# EAGLE design ECS_device (EAGLE 5.11)
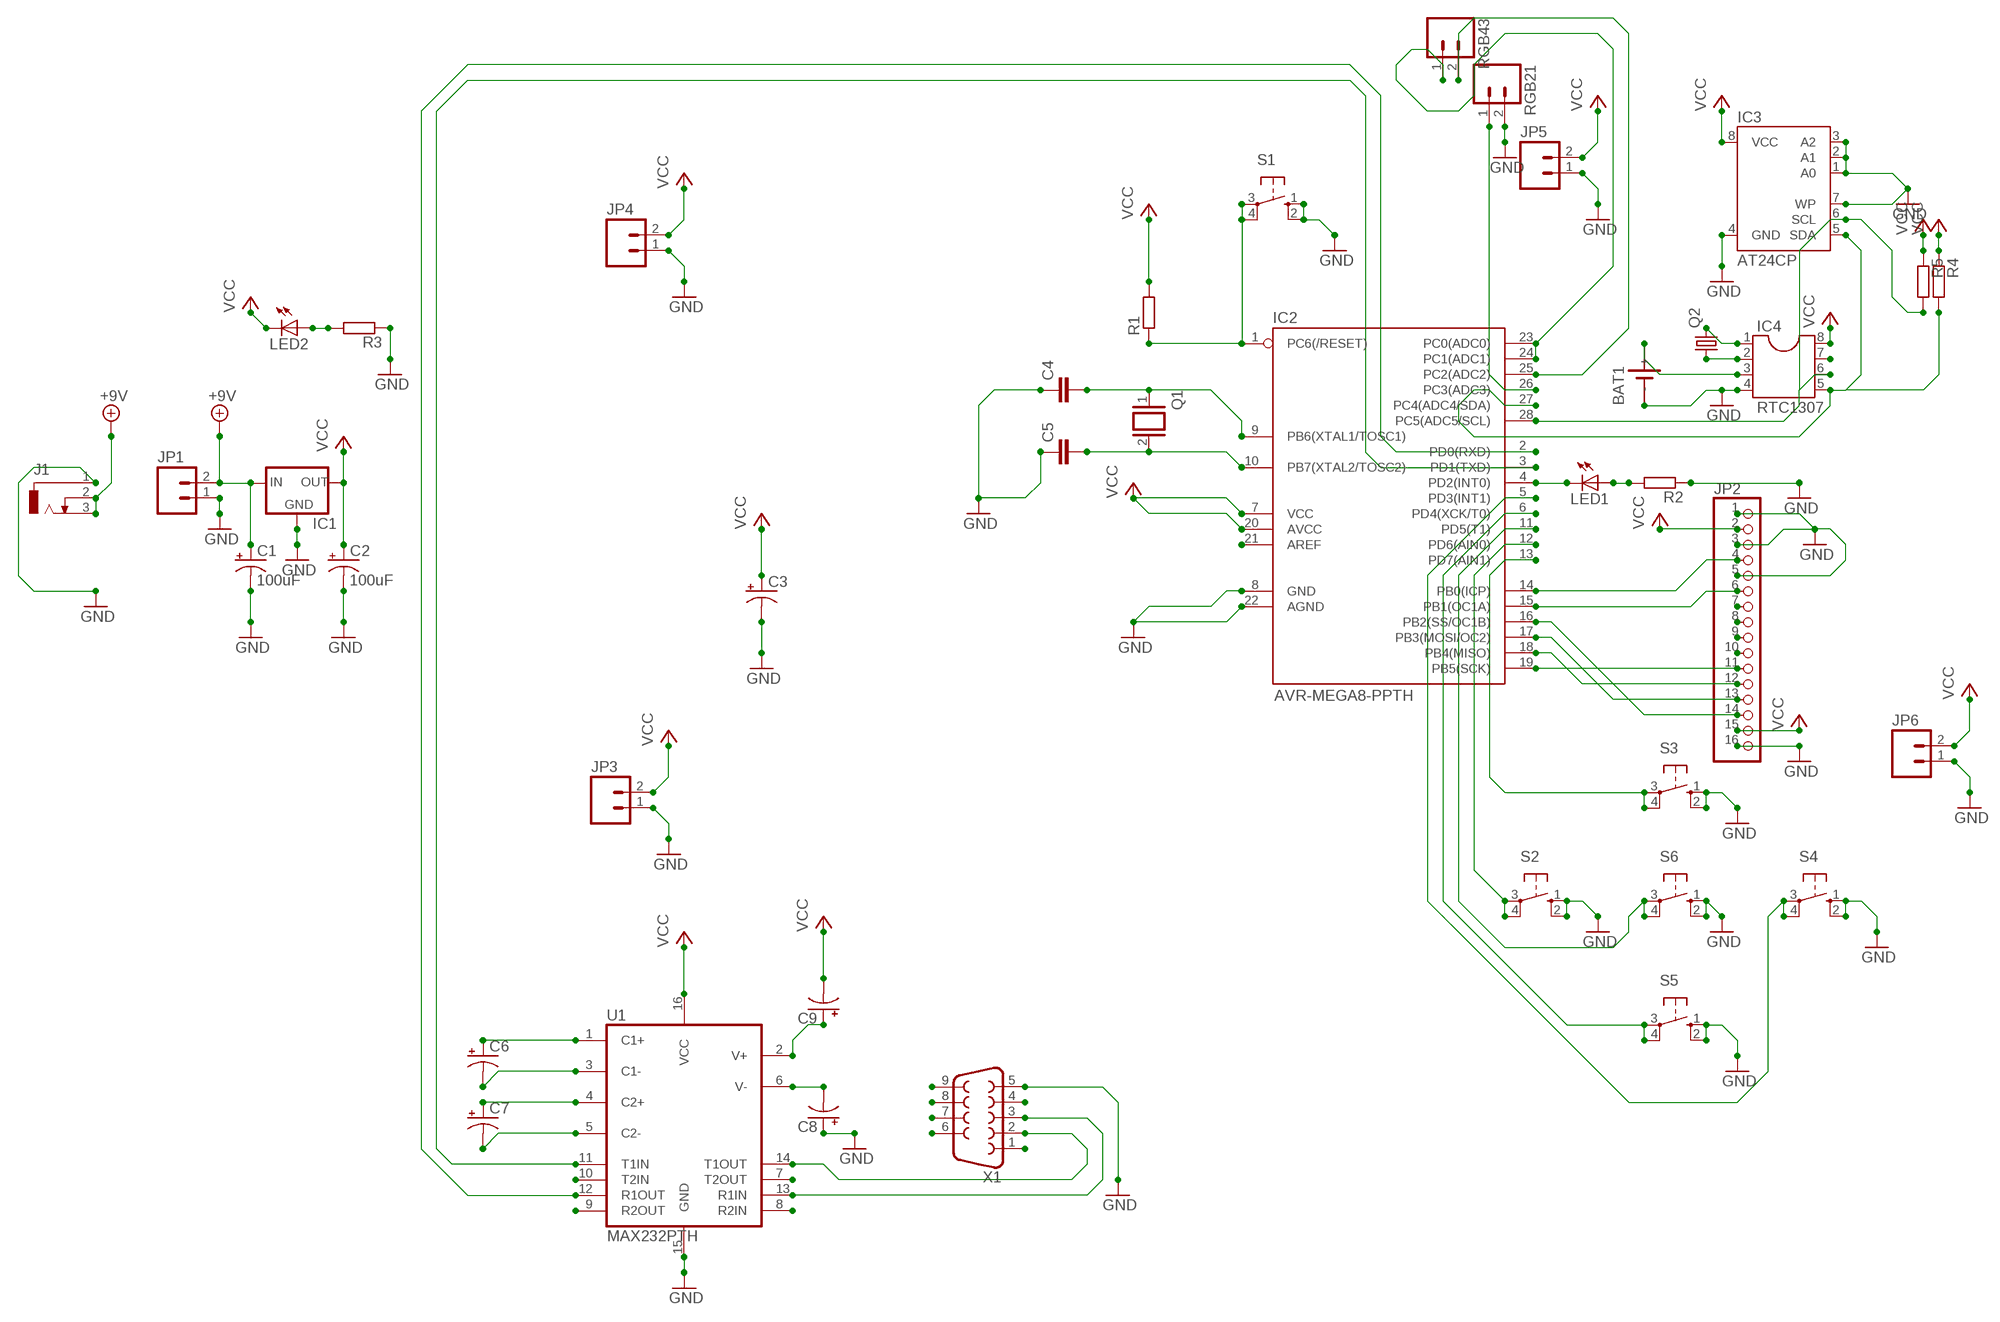
[diagram p0: schematic, sheet 1]

## Parts
BAT1  SN2032  [SN2032]
C1  100uF  CAP_POLPTH1  [CPOL-RADIAL-100UF-25V]
C2  100uF  CAP_POLPTH1  [CPOL-RADIAL-100UF-25V]
C3  CAP_POLPTH2  [CPOL-RADIAL-10UF-25V]
C4  CAPPTH1  [CAP-PTH-5MM]
C5  CAPPTH1  [CAP-PTH-5MM]
C6  CAP_POLPTH2  [CPOL-RADIAL-10UF-25V]
C7  CAP_POLPTH2  [CPOL-RADIAL-10UF-25V]
C8  CAP_POLPTH2  [CPOL-RADIAL-10UF-25V]
C9  CAP_POLPTH2  [CPOL-RADIAL-10UF-25V]
IC1  V_REG_78XX-TO-220  [TO-220-ALT]
IC2  AVR-MEGA8-PPTH  [DIL28-3]
IC3  AT24CP  [DIL08]
IC4  RTC1307  DIL8  [DIL08]
J1  DCJ0303  [DCJ0303]
JP1  M02PTH3  [1X02_LONGPADS]
JP2  PINHD-1X16/90  [1X16/90]
JP3  M02PTH3  [1X02_LONGPADS]
JP4  M02PTH3  [1X02_LONGPADS]
JP5  M02PTH3  [1X02_LONGPADS]
JP6  M02PTH3  [1X02_LONGPADS]
LED1  LEDSFH482  [SFH482]
LED2  LEDSFH482  [SFH482]
Q1  XTAL  [Q]
Q2  CRYSTALTC38H  [TC38H]
R1  R-EU_0309/12  [0309/12]
R2  R-EU_0309/12  [0309/12]
R3  R-EU_0309/12  [0309/12]
R4  R-EU_0309/12  [0309/12]
R5  R-EU_0309/12  [0309/12]
RGB21  M02PTH3  [1X02_LONGPADS]
RGB43  M02PTH3  [1X02_LONGPADS]
S1  10-XX  [B3F-10XX]
S2  10-XX  [B3F-10XX]
S3  10-XX  [B3F-10XX]
S4  10-XX  [B3F-10XX]
S5  10-XX  [B3F-10XX]
S6  10-XX  [B3F-10XX]
U1  MAX232PTH  [DIL16]
X1  DB9FEMALE  [DB9]

## Nets
+9V: C1.1(+) IC1.IN J1.2 J1.3 JP1.2
GND: BAT1.- C1.2(-) C2.2(-) C3.2(-) C4.1 C5.1 C8.1(+) IC1.GND IC2.8(GND) IC2.22(AGND) IC3.1(A0) IC3.2(A1) IC3.3(A2) IC3.4(GND) IC3.7(WP) IC4.4 J1.1 JP1.1 JP2.1 JP2.3 JP2.5 JP2.16 JP3.1 JP4.1 JP5.1 JP6.1 R2.1 R3.1 RGB21.2 S1.1(S) S1.2(S1) S2.1(S) S2.2(S1) S3.1(S) S3.2(S1) S4.1(S) S4.2(S1) S5.1(S) S5.2(S1) S6.1(S) S6.2(S1) U1.15(GND) X1.5
N$1: IC2.2(PD0(RXD)) U1.12(R1OUT)
N$3: IC2.21(AREF)
N$5: IC2.14(PB0(ICP)) JP2.4
N$6: IC2.28(PC5(ADC5/SCL)) IC3.6(SCL) IC4.6 R5.2
N$7: IC2.27(PC4(ADC4/SDA)) IC3.5(SDA) IC4.5 R4.2
N$8: C5.2 IC2.10(PB7(XTAL2/TOSC2)) Q1.2
N$9: C4.2 IC2.9(PB6(XTAL1/TOSC1)) Q1.1
N$19: IC2.1(PC6(/RESET)) R1.1 S1.3(P) S1.4(P1)
N$30: IC2.16(PB2(SS/OC1B)) JP2.14
N$31: IC2.17(PB3(MOSI/OC2)) JP2.13
N$32: IC2.18(PB4(MISO)) JP2.12
N$34: IC2.19(PB5(SCK)) JP2.11
N$35: JP2.10
N$36: JP2.9
N$37: JP2.8
N$38: JP2.7
N$39: C6.1(+) U1.1(C1+)
N$40: C6.2(-) U1.3(C1-)
N$41: C7.1(+) U1.4(C2+)
N$42: C7.2(-) U1.5(C2-)
N$43: IC2.3(PD1(TXD)) U1.11(T1IN)
N$44: U1.10(T2IN)
N$46: U1.9(R2OUT)
N$47: IC4.7
N$50: C8.2(-) U1.6(V-)
N$51: BAT1.+ IC4.3
N$52: U1.7(T2OUT)
N$53: IC4.2 Q2.1
N$54: U1.8(R2IN)
N$55: IC4.1 Q2.2
N$58: C9.1(+) U1.2(V+)
N$59: IC2.26(PC3(ADC3)) RGB21.1
N$60: X1.4
N$61: U1.13(R1IN) X1.3
N$62: U1.14(T1OUT) X1.2
N$63: X1.1
N$64: X1.6
N$65: X1.7
N$66: X1.8
N$67: X1.9
N$68: IC2.25(PC2(ADC2)) RGB43.2
N$69: IC2.24(PC1(ADC1)) RGB43.1
N$70: IC2.23(PC0(ADC0))
N$73: IC2.4(PD2(INT0)) LED1.K(C)
N$74: IC2.5(PD3(INT1)) S4.3(P) S4.4(P1)
N$75: IC2.6(PD4(XCK/T0)) S5.3(P) S5.4(P1)
N$76: IC2.11(PD5(T1)) S6.3(P) S6.4(P1)
N$77: IC2.12(PD6(AIN0)) S2.3(P) S2.4(P1)
N$78: IC2.13(PD7(AIN1)) S3.3(P) S3.4(P1)
N$80: IC2.15(PB1(OC1A)) JP2.6
N$86: LED1.A R2.2
N$90: LED2.A R3.2
VCC: C2.1(+) C3.1(+) C9.2(-) IC1.OUT IC2.7(VCC) IC2.20(AVCC) IC3.8(VCC) IC4.8 JP2.2 JP2.15 JP3.2 JP4.2 JP5.2 JP6.2 LED2.K(C) R1.2 R4.1 R5.1 U1.16(VCC)

## Library data of the parts
BAT1 = sn2032:SN2032: LI BATTERY
C1-C3 C6-C9 = SparkFun:CAP_POL: Capacitor Polarized These are standard SMD and PTH capacitors. Normally 10uF, 47uF, and 100uF in electrolytic and tantalum varieties. Always verify the external diameter of the through hole cap, it varies with capacity, voltage, and manufacturer. The EIA devices should be standard.
C4 C5 = SparkFun:CAP: Capacitor Standard 0603 ceramic capacitor, and 0.1" leaded capacitor.
IC1 = SparkFun:V_REG_78XX: Voltage Regulator Standard 7805 5V regulator. IGO (Input Ground Output). Spark Fun Electronics SKU : COM-00107
IC2 = SparkFun:AVR-MEGA8-P: MICROCONTROLLER 8 Kbytes FLASH 1 kbytes SRAM 512 bytes EEPROM USART 4-channel 10 bit ADC 2-channel 8 bit ADC
IC3 = atmel:AT24C*: 2-wire serial EEPROM; MPN: AT24C1024BW-SH-B; OC_FARNELL: 1362646; OC_NEWARK: 03P2044
IC4 = ic-package:DIL8: Dual In Line / Socket
J1 = con-jack:DCJ0303: DC POWER JACK Source: DCJ0303.pdf; OC_FARNELL: unknown; OC_NEWARK: unknown
JP1 JP3-JP6 RGB21 RGB43 = SparkFun:M02: Header 2 Standard 2-pin 0.1" header. Use with straight break away headers (SKU : PRT-00116), right angle break away headers (PRT-00553), swiss pins (PRT-00743), machine pins (PRT-00117), and female headers (PRT-00115). Molex polarized connector foot print use with SKU : PRT-08233 with associated crimp pins and housings.
JP2 = pinhead:PINHD-1X16: PIN HEADER
LED1 LED2 = led:LED: LED OSRAM: - CHIPLED LG R971, LG N971, LY N971, LG Q971, LY Q971, LO R971, LY R971 LH N974, LH R974 LS Q976, LO Q976, LY Q976 LO Q996 - Hyper CHIPLED LW Q18S LB Q993, LB Q99A, LB R99A - SideLED LS A670, LO A670, LY A670, LG A670, LP A670 LB A673, LV A673, LT A673, LW A673 LH A674 LY A675 LS A676, LA A676, LO A676, LY A676, LW A676 LS A679, LY A679, LG A679 - Hyper Micro SIDELED® LS Y876, LA Y876, LO Y876, LY Y876 LT Y87S - SmartLED LW L88C, LW L88S LB L89C, LB L89S, LG L890 LS L89K, LO L89K, LY L89K LS L896, LA L896, LO L896, LY L896 - TOPLED LS T670, LO T670, LY T670, LG T670, LP T670 LSG T670, LSP T670, LSY T670, LOP T670, LYG T670 LG T671, LOG T671, LSG T671 LB T673, LV T673, LT T673, LW T673 LH T674 LS T676, LA T676, LO T676, LY T676, LB T676, LH T676, LSB T676, LW T676 LB T67C, LV T67C, LT T67C, LS T67K, LO T67K, LY T67K, LW E67C LS E67B, LA E67B, LO E67B, LY E67B, LB E67C, LV E67C, LT E67C LW T67C LS T679, LY T679, LG T679 LS T770, LO T770, LY T770, LG T770, LP T770 LB T773, LV T773, LT T773, LW T773 LH T774 LS E675, LA E675, LY E675, LS T675 LS T776, LA T776, LO T776, LY T776, LB T776 LHGB T686 LT T68C, LB T68C - Hyper Mini TOPLED® LB M676 - Mini TOPLED Santana® LG M470 LS M47K, LO M47K, LY M47K Source: http://www.osram.convergy.de LUXEON: - LUMILED® LXK2-PW12-R00, LXK2-PW12-S00, LXK2-PW14-U00, LXK2-PW14-V00 LXK2-PM12-R00, LXK2-PM12-S00, LXK2-PM14-U00 LXK2-PE12-Q00, LXK2-PE12-R00, LXK2-PE12-S00, LXK2-PE14-T00, LXK2-PE14-U00 LXK2-PB12-K00, LXK2-PB12-L00, LXK2-PB12-M00, LXK2-PB14-N00, LXK2-PB14-P00, LXK2-PB14-Q00 LXK2-PR12-L00, LXK2-PR12-M00, LXK2-PR14-Q00, LXK2-PR14-R00 LXK2-PD12-Q00, LXK2-PD12-R00, LXK2-PD12-S00 LXK2-PH12-R00, LXK2-PH12-S00 LXK2-PL12-P00, LXK2-PL12-Q00, LXK2-PL12-R00 Source: www.luxeon.com KINGBRIGHT: KA-3528ASYC Source: www.kingbright.com
Q1 = special:XTAL: CRYSTAL
Q2 = crystal:CRYSTAL: CRYSTAL; OC_FARNELL: unknown; OC_NEWARK: unknown
R1-R5 = resistor:R-EU_: RESISTOR, European symbol
S1-S6 = switch-omron:10-XX: OMRON SWITCH; MPN: B3F-1000; OC_FARNELL: 176432; OC_NEWARK: 36M3542
U1 = SparkFun:MAX232: RS232 Transceiver Very common IC. This is generically called 'MAX232', but works with the 3V equivalent MAX3232 generic ICs. Field tested and mother approved. Spark Fun Electronics SKU : COM-00316 (DIP) and COM-00589 (SMD)
X1 = SparkFun:DB9: DB9 Connector Standard DB9 (D-Sub 9) serial connector. Can be used for CAN bus as well as RS485 and RS232. Footprint production proven. Spark Fun Electronics SKU : PRT-00429

## Board
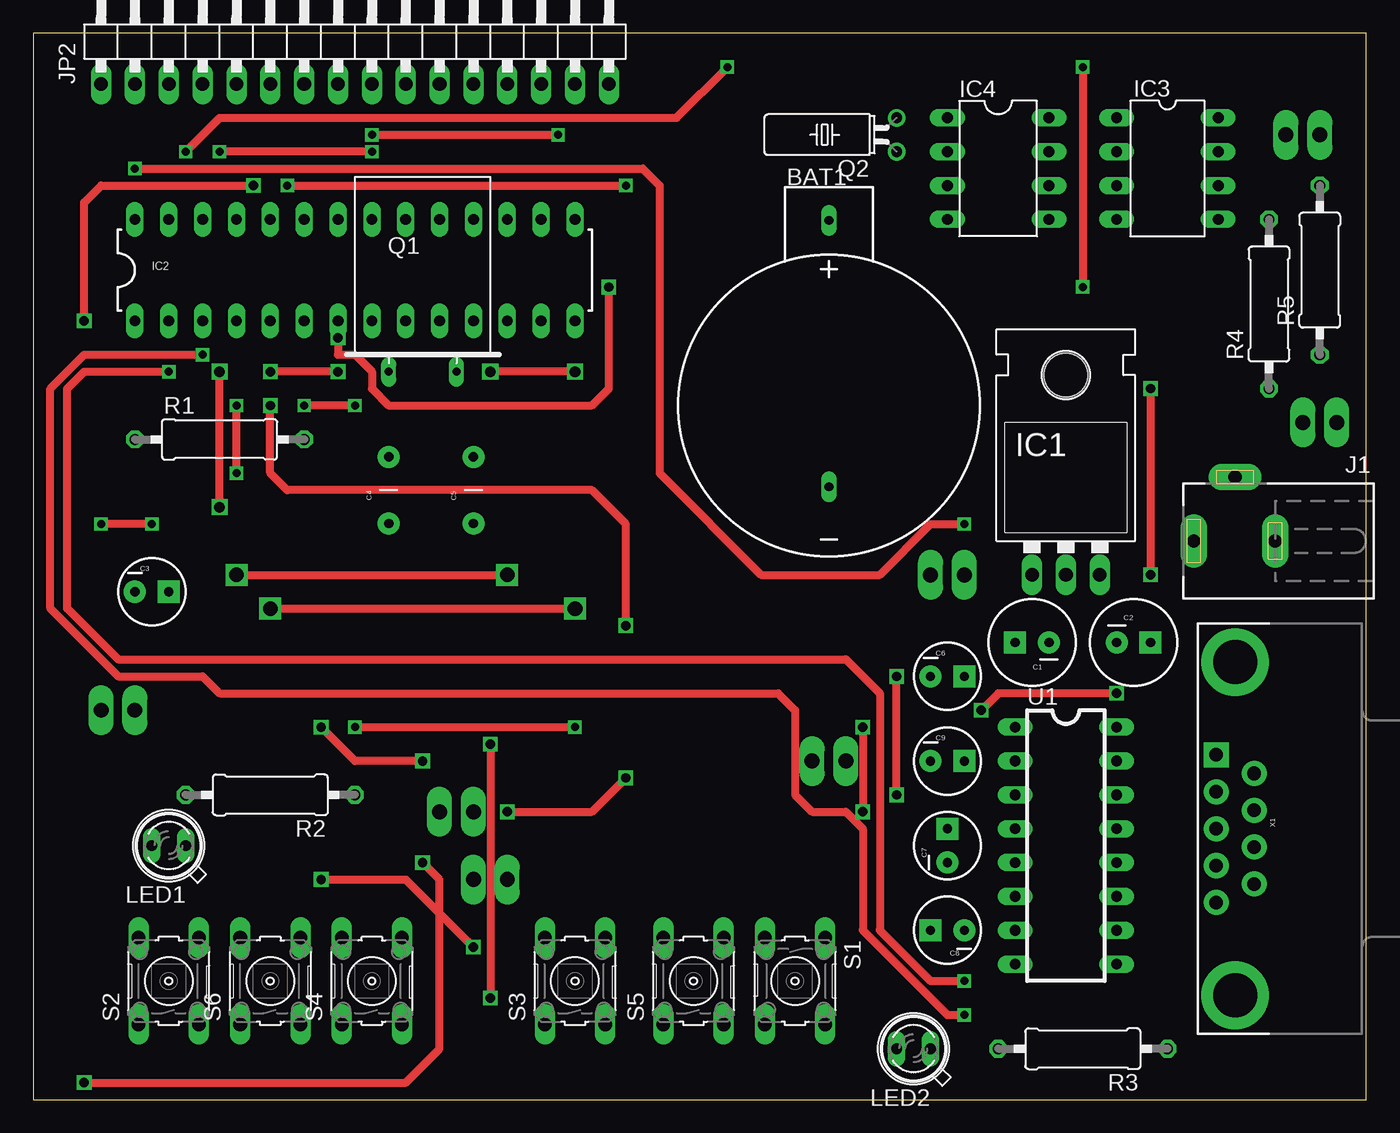
[diagram p1: board, top side]
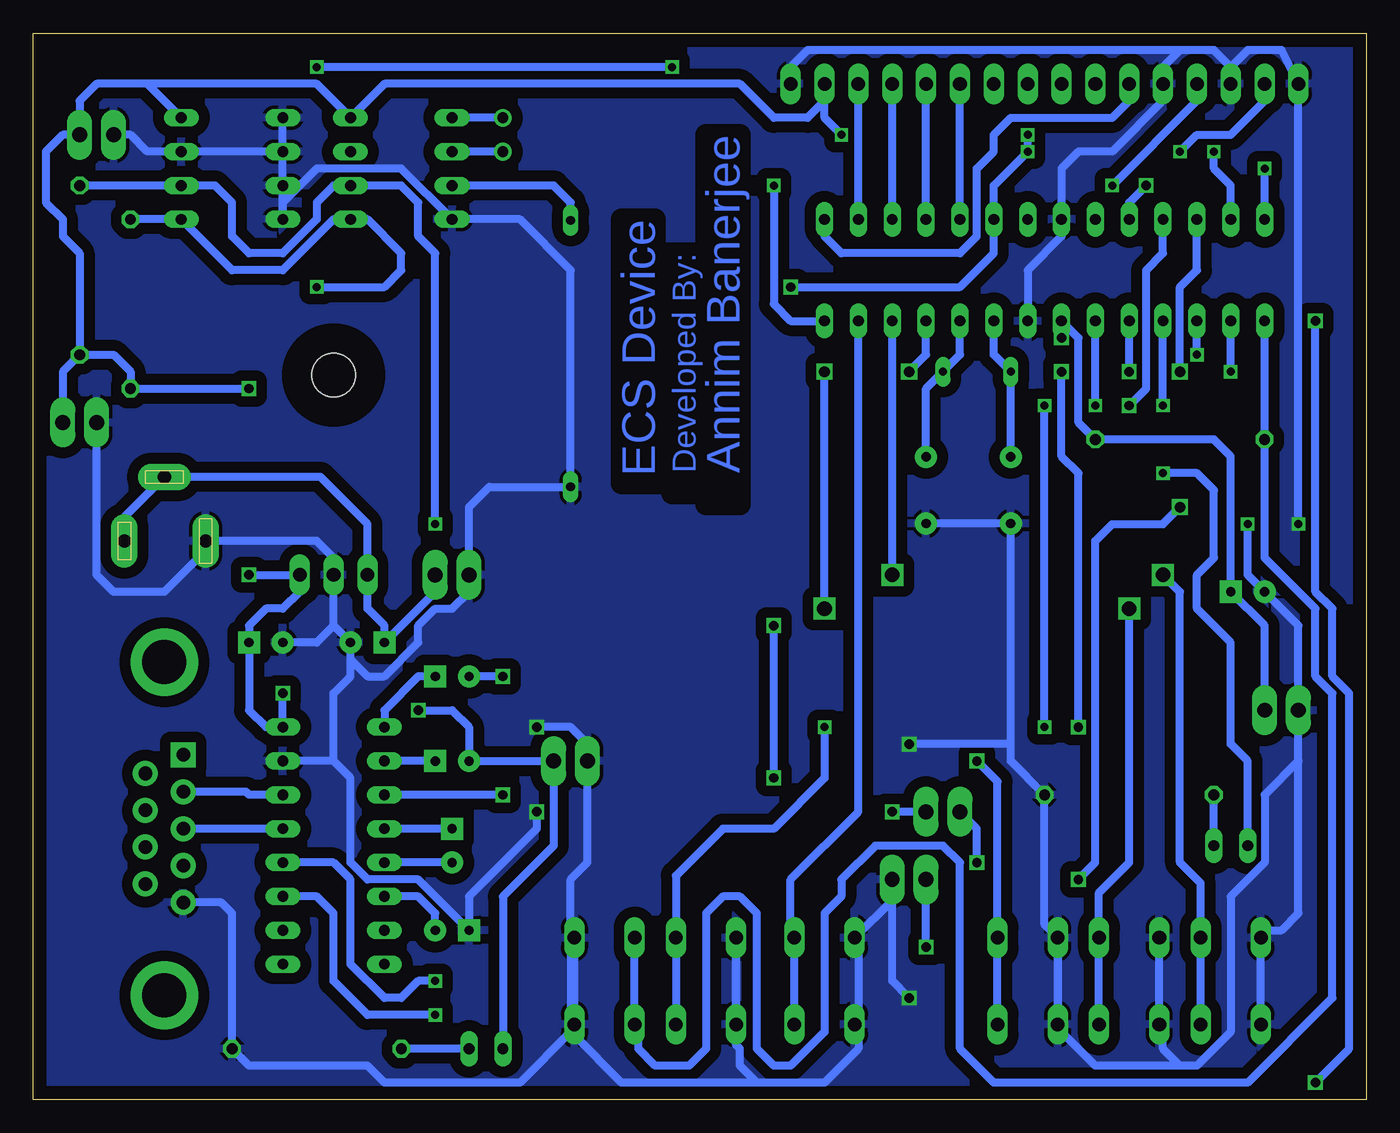
[diagram p2: board, bottom side, seen from below]

Size 100 x 80 mm. Coordinates in mm from the lower left corner, seen from the top.
Outline: 0,0 100,0 100,80 0,80 0,0
Copper layers (1*16): Top 0.035mm / dielectric 1.5mm / Bottom 0.035mm
Design rules "default": minimum track width 10mil, minimum drill 24mil, track to track 8mil, track to pad 8mil, pad to pad 8mil, via to via 8mil, smd to smd 8mil, copper to edge 40mil, drill to drill 8mil, minimum pad ring 10mil, minimum via ring 8mil, stop-mask expansion 4mil, vias tented up to drill 0mil, thermal gap 10mil

### Footprints (pad centres in the part's own frame; a part is rotated, then mirrored left to right if it is on the bottom)
SN2032 = drill 0.65 long: + 0,13.9; - 0,-6.1
CPOL-RADIAL-100UF-25V = drill 0.7 pad 1.651 square: 1 1.27,0 | drill 0.7 pad 1.651 round: 2 -1.27,0
CPOL-RADIAL-10UF-25V = drill 0.7 pad 1.651 square: 1 1.27,0 | drill 0.7 pad 1.651 round: 2 -1.27,0
CAP-PTH-5MM = drill 0.7 pad 1.651 round: 1 -2.5,0; 2 2.5,0
TO-220-ALT = drill 1.016 long: GND 0,-3.81; IN -2.54,-3.81; OUT 2.54,-3.81 | hole 3.302: 0,11.176
DIL28-3 = drill 0.813 long: 1 -16.51,-3.81; 2 -13.97,-3.81; 3 -11.43,-3.81; 4 -8.89,-3.81; 5 -6.35,-3.81; 6 -3.81,-3.81; 7 -1.27,-3.81; 8 1.27,-3.81; 9 3.81,-3.81; 10 6.35,-3.81; 11 8.89,-3.81; 12 11.43,-3.81; 13 13.97,-3.81; 14 16.51,-3.81; 15 16.51,3.81; 16 13.97,3.81; 17 11.43,3.81; 18 8.89,3.81; 19 6.35,3.81; 20 3.81,3.81; 21 1.27,3.81; 22 -1.27,3.81; 23 -3.81,3.81; 24 -6.35,3.81; 25 -8.89,3.81; 26 -11.43,3.81; 27 -13.97,3.81; 28 -16.51,3.81
DIL08 = drill 0.813 long: 1 -3.81,-3.81; 2 -1.27,-3.81; 3 1.27,-3.81; 4 3.81,-3.81; 5 3.81,3.81; 6 1.27,3.81; 7 -1.27,3.81; 8 -3.81,3.81
DCJ0303 = drill 1 pad 2 long: 1 0,3.1; 2 4.8,0; 3 0,-3
1X02_LONGPADS = drill 1.118 pad 1.88 long: 1 0,0; 2 2.54,0
1X16/90 = drill 1.016 long: 1 -19.05,-3.81; 2 -16.51,-3.81; 3 -13.97,-3.81; 4 -11.43,-3.81; 5 -8.89,-3.81; 6 -6.35,-3.81; 7 -3.81,-3.81; 8 -1.27,-3.81; 9 1.27,-3.81; 10 3.81,-3.81; 11 6.35,-3.81; 12 8.89,-3.81; 13 11.43,-3.81; 14 13.97,-3.81; 15 16.51,-3.81; 16 19.05,-3.81
SFH482 = drill 0.813 long: A -1.27,0; K 1.27,0
Q = drill 0.61 long: 1 -2.54,-7.62; 2 2.54,-7.62
TC38H = drill 0.813 round: 1 -1.27,0; 2 1.27,0
0309/12 = drill 0.813 octagon: 1 -6.35,0; 2 6.35,0
B3F-10XX = drill 1.016 long: 1 -3.251,2.261; 2 3.251,2.261; 3 -3.251,-2.261; 4 3.251,-2.261
DIL16 = drill 0.813 long: 1 -8.89,-3.81; 2 -6.35,-3.81; 3 -3.81,-3.81; 4 -1.27,-3.81; 5 1.27,-3.81; 6 3.81,-3.81; 7 6.35,-3.81; 8 8.89,-3.81; 9 8.89,3.81; 10 6.35,3.81; 11 3.81,3.81; 12 1.27,3.81; 13 -1.27,3.81; 14 -3.81,3.81; 15 -6.35,3.81; 16 -8.89,3.81
DB9 = drill 1.016 pad 1.88 square: 1 -5.54,-1.42 | drill 1.016 pad 1.88 round: 2 -2.77,-1.42; 3 0,-1.42; 4 2.77,-1.42; 5 5.54,-1.42; 6 -4.15,1.42; 7 -1.38,1.42; 8 1.38,1.42; 9 4.15,1.42 | drill 3.302 pad 5.08 round: G1 -12.5,0; G2 12.5,0

### Placement (x,y rotation side)
BAT1  59.69,52.07 0 top
C1  74.93,34.29 180 top
C2  82.55,34.29 0 top
C3  8.89,38.1 0 top
C4  26.67,45.72 90 top
C5  33.02,45.72 90 top
C6  68.58,31.75 0 top
C7  68.58,19.05 90 top
C8  68.58,12.7 180 top
C9  68.58,25.4 0 top
IC1  77.47,43.18 0 top
IC2  24.13,62.23 0 top
IC3  85.09,69.85 270 top
IC4  72.39,69.85 270 top
J1  90.17,41.91 90 top
JP1  67.31,39.37 0 top
JP2  24.13,80.01 0 top
JP3  5.08,29.21 0 top
JP4  93.98,72.39 0 top
JP5  58.42,25.4 0 top
JP6  95.25,50.8 0 top
LED1  10.16,19.05 180 top
LED2  66.04,3.81 180 top
Q1  29.21,62.23 0 top
Q2  64.77,72.39 90 top
R1  13.97,49.53 0 top
R2  17.78,22.86 180 top
R3  78.74,3.81 180 top
R4  92.71,59.69 90 top
R5  96.52,62.23 90 top
RGB21  33.02,16.51 0 top
RGB43  30.48,21.59 0 top
S1  57.15,8.89 270 top
S2  10.16,8.89 90 top
S3  40.64,8.89 90 top
S4  25.4,8.89 90 top
S5  49.53,8.89 90 top
S6  17.78,8.89 90 top
U1  77.47,19.05 270 top
X1  90.17,20.32 270 top

### Tracks (layer width: path | path; a pad name or v marks a point on that pad's centre or on a via)
+9V
  Bottom 0.61: JP1.2 69.85,38.1 C1.1 73.66,35.56 74.93,36.83 IC1.IN 74.93,43.18 78.46,46.71 J1.2 93.17,43.71 J1.3
GND  (via drill 0.6, 0.7)
  Top 0.61: v8.89,43.18 v5.08,43.18 | v62.23,27.94 v62.23,21.59 | v34.29,26.67 v34.29,7.62
  Bottom 0.61: 77.47,35.56 IC1.GND 77.47,40.64 78.74,41.91 J1.1 87.07,41.2 90.17,38.1 93.98,38.1 95.25,39.37 JP6.1 | 77.47,35.56 C1.2 76.2,33.02 | C2.2 78.74,34.29 77.47,35.56 | 76.2,33.02 74.93,31.75 73.66,31.75 71.12,34.29 71.12,35.56 69.85,36.83 68.58,36.83 67.31,38.1 JP1.1 67.31,44.45 65.79,45.97 BAT1.- 59.69,62.23 63.5,66.04 IC4.4 72.39,69.85 78.74,69.85 81.28,67.31 IC3.4 IC3.3 IC3.2 | X1.5 85.9,14.78 85.09,13.97 R3.1 83.82,2.54 74.93,2.54 73.66,1.27 63.5,1.27 59.69,5.08 59.69,12.42 | 5.08,25.4 5.08,13.97 6.35,12.7 7.34,12.7 S2.2 S2.1 | 5.08,25.4 JP3.1 5.08,35.56 C3.2 8.89,39.37 v8.89,43.18 | C5.1 C4.1 26.67,26.67 | 26.67,26.67 26.67,25.4 R2.1 24.13,13.13 S4.2 | 5.08,25.4 7.62,22.86 7.62,17.78 10.16,15.24 10.16,5.08 12.7,2.54 13.97,2.54 | 15.52,11.71 S6.2 S6.1 15.24,5.36 15.24,3.81 13.97,2.54 | 35.56,14.96 RGB21.2 | 35.56,14.96 S3.2 38.1,11.86 38.1,5.92 S3.1 38.1,5.36 38.1,3.81 40.64,1.27 45.72,1.27 | S4.2 S4.1 | S4.2 23.14,5.36 20.32,2.54 13.97,2.54 | S5.1 S5.2 47.27,4.09 46.99,3.81 46.99,2.54 45.72,1.27 | 45.72,1.27 55.88,1.27 59.41,4.8 S1.2 S1.1 59.69,12.42 | 59.69,12.42 59.69,16.51 58.42,17.78 JP5.1 58.42,26.67 59.69,27.94 v62.23,27.94 | v5.08,43.18 JP2.1 6.35,78.74 8.89,78.74 10.16,77.47 | 10.16,77.47 JP2.3 | 10.16,77.47 11.43,78.74 13.97,78.74 | 13.97,78.74 15.24,77.47 JP2.5 15.24,74.93 19.05,71.12 21.59,71.12 22.86,69.85 IC2.22 22.86,64.77 25.4,62.23 IC2.8 | JP2.16 43.18,77.47 41.91,78.74 13.97,78.74 | JP4.1 92.71,72.39 91.44,71.12 IC3.7 IC3.2 | IC3.2 IC3.1 | 77.47,25.4 76.2,24.13 76.2,17.78 74.93,16.51 71.12,16.51 C8.1 67.31,15.24 62.23,20.32 v62.23,21.59
  Bottom 0.61: 77.47,25.4 U1.15 | 77.47,25.4 77.47,30.48 76.2,31.75 76.2,33.02 | 35.56,14.96 35.56,8.89 v34.29,7.62 | 26.67,26.67 v34.29,26.67
  pour Bottom (isolate 0.813): 0,80.01 0,0 100.33,0 100.33,80.01
N$1  (via drill 0.6)
  Top 0.61: v69.85,8.89 67.31,8.89 63.5,12.7 63.5,30.48 60.96,33.02 6.35,33.02 2.54,36.83 2.54,53.34 3.81,54.61 v10.16,54.61
  Bottom 0.61: U1.12 77.47,17.78 76.2,16.51 76.2,10.16 73.66,7.62 72.39,7.62 71.12,8.89 v69.85,8.89 | v10.16,54.61 IC2.2
N$5  (via drill 0.6)
  Top 0.61: v19.05,68.58 v44.45,68.58
  Bottom 0.61: JP2.4 12.7,74.93 v19.05,68.58 | v44.45,68.58 44.45,59.69 43.18,58.42 IC2.14
N$6  (via drill 0.6)
  Top 0.61: v69.85,43.18 67.31,43.18 63.5,39.37 54.61,39.37 46.99,46.99 46.99,68.58 45.72,69.85 v7.62,69.85
  Bottom 0.61: R5.2 IC3.6 86.36,68.58 85.09,67.31 85.09,64.77 83.82,63.5 81.28,63.5 78.74,66.04 78.74,67.31 77.47,68.58 IC4.6 72.39,68.58 71.12,67.31 71.12,64.77 69.85,63.5 v69.85,43.18 | IC2.28 v7.62,69.85
N$7  (via drill 0.6)
  Top 0.61: v78.74,77.47 v78.74,60.96 | v52.07,77.47 48.26,73.66 13.97,73.66 v11.43,71.12
  Bottom 0.61: R4.2 IC3.5 85.09,62.23 81.28,62.23 77.47,66.04 IC4.5 74.93,66.04 72.39,63.5 72.39,62.23 73.66,60.96 v78.74,60.96 | v52.07,77.47 v78.74,77.47 | v11.43,71.12 11.43,69.85 10.16,68.58 IC2.27
N$8
  Bottom 0.61: IC2.10 30.48,55.88 Q1.2 33.02,53.34 C5.2
N$9
  Bottom 0.61: IC2.9 27.94,55.88 Q1.1 C4.2
N$19
  Bottom 0.61: IC2.1 R1.1 7.62,40.64 3.81,36.83 3.81,31.75 2.54,30.48 2.54,7.62 8.89,1.27 27.94,1.27 30.48,3.81 30.48,17.78 31.75,19.05 36.83,19.05 39.37,16.51 39.37,15.24 40.64,13.97 40.64,5.08 43.18,2.54 44.45,2.54 45.72,3.81 45.72,13.97 46.99,15.24 48.26,15.24 49.53,13.97 49.53,3.81 50.8,2.54 53.34,2.54 54.61,3.81 54.61,5.36 S1.4 S1.3
N$30
  Bottom 0.61: IC2.16 JP2.14
N$31
  Bottom 0.61: IC2.17 JP2.13
N$32
  Bottom 0.61: IC2.18 JP2.12
N$34
  Bottom 0.61: IC2.19 JP2.11
N$39
  Bottom 0.61: U1.1 73.66,29.21 71.12,31.75 C6.1
N$40  (via drill 0.7)
  Top 0.61: v64.77,22.86 v64.77,31.75
  Bottom 0.61: v64.77,22.86 U1.3 | v64.77,31.75 C6.2
N$41
  Bottom 0.61: C7.1 U1.4
N$42
  Bottom 0.61: C7.2 U1.5
N$43  (via drill 0.6)
  Top 0.61: v69.85,6.35 68.58,6.35 62.23,12.7 62.23,20.32 60.96,21.59 58.42,21.59 57.15,22.86 57.15,29.21 55.88,30.48 13.97,30.48 12.7,31.75 6.35,31.75 1.27,36.83 1.27,53.34 3.81,55.88 v12.7,55.88
  Bottom 0.61: U1.11 78.74,15.24 77.47,13.97 77.47,8.89 74.93,6.35 v69.85,6.35 | v12.7,55.88 IC2.3
N$50
  Bottom 0.61: U1.6 71.12,15.24 69.85,13.97 C8.2
N$51
  Bottom 0.61: IC4.3 60.96,68.58 59.69,67.31 BAT1.+
N$53
  Bottom 0.61: Q2.1 IC4.2
N$55
  Bottom 0.61: Q2.2 IC4.1
N$58
  Bottom 0.61: C9.1 U1.2
N$59  (via drill 0.7, 0.8)
  Top 0.61: v13.97,44.45 v13.97,54.61 | v21.59,16.51 27.94,16.51 v33.02,11.43
  Bottom 0.61: IC2.26 12.7,62.23 13.97,60.96 v13.97,54.61 | v13.97,44.45 15.24,43.18 19.05,43.18 20.32,41.91 20.32,17.78 v21.59,16.51 | v33.02,11.43 RGB21.1
N$61
  Bottom 0.61: U1.13 X1.3
N$62
  Bottom 0.61: X1.2 84.05,23.09 83.82,22.86 U1.14
N$68  (via drill 0.7)
  Top 0.61: v17.78,52.07 17.78,46.99 19.05,45.72 41.91,45.72 44.45,43.18 v44.45,35.56 | v44.45,24.13 41.91,21.59 v35.56,21.59
  Bottom 0.61: IC2.25 15.24,63.5 16.51,62.23 16.51,53.34 v17.78,52.07 | v44.45,24.13 v44.45,35.56 | RGB43.2 v35.56,21.59
N$69  (via drill 0.7)
  Top 0.61: v16.51,68.58 5.08,68.58 3.81,67.31 v3.81,58.42 | v3.81,1.27 27.94,1.27 30.48,3.81 30.48,16.51 v29.21,17.78
  Bottom 0.61: IC2.24 17.78,67.31 v16.51,68.58 | v3.81,58.42 3.81,38.1 2.54,36.83 2.54,31.75 1.27,30.48 1.27,3.81 v3.81,1.27 | v29.21,17.78 29.21,20.32 RGB43.1
N$73  (via drill 0.6)
  Top 0.61: v15.24,46.99 v15.24,52.07
  Bottom 0.61: v15.24,52.07 IC2.4 | v15.24,46.99 12.7,46.99 11.43,45.72 11.43,40.64 12.7,39.37 12.7,36.83 10.16,34.29 10.16,26.67 8.89,25.4 LED1.K
N$74  (via drill 0.7)
  Top 0.61: v29.21,25.4 24.13,25.4 v21.59,27.94 | v22.86,54.61 v17.78,54.61
  Bottom 0.61: S4.3 S4.4 27.66,23.85 v29.21,25.4 | v21.59,27.94 21.59,46.99 22.86,48.26 v22.86,54.61 | v17.78,54.61 IC2.5
N$75  (via drill 0.6)
  Top 0.61: v24.13,27.94 v40.64,27.94 | v24.13,52.07 v20.32,52.07
  Bottom 0.61: S5.3 S5.4 51.79,16.79 48.26,20.32 44.45,20.32 40.64,24.13 v40.64,27.94 | v24.13,27.94 v24.13,52.07 | v20.32,52.07 IC2.6
N$76  (via drill 0.8, 1.1)
  Top 0.61: v17.78,36.83 v40.64,36.83 | v40.64,54.61 v34.29,54.61
  Bottom 0.61: S6.3 S6.4 20.04,15.52 17.78,17.78 v17.78,36.83 | v40.64,36.83 v40.64,54.61 | v34.29,54.61 33.02,55.88 IC2.11
N$77  (via drill 1.1)
  Top 0.61: v15.24,39.37 v35.56,39.37
  Bottom 0.61: S2.3 S2.4 12.42,16.23 13.97,17.78 13.97,38.1 v15.24,39.37 | v35.56,39.37 IC2.12
N$78
  Bottom 0.61: S3.3 S3.4 43.18,12.42 43.18,16.51 38.1,21.59 IC2.13
N$80
  Bottom 0.61: JP2.6 17.78,74.93 19.05,73.66 26.67,73.66 27.94,72.39 27.94,71.12 29.21,69.85 29.21,64.77 30.48,63.5 39.37,63.5 40.64,64.77 IC2.15
N$86
  Bottom 0.61: LED1.A R2.2
N$90
  Bottom 0.61: LED2.A R3.2
VCC  (via drill 0.6, 0.7)
  Top 0.61: v25.4,71.12 v13.97,71.12 | v25.4,72.39 v39.37,72.39 | v81.28,30.48 72.39,30.48 v71.12,29.21 | v83.82,53.34 v83.82,39.37 | v22.86,57.15 22.86,55.88 24.13,55.88 25.4,54.61 25.4,53.34 26.67,52.07 41.91,52.07 43.18,53.34 v43.18,60.96
  Bottom 0.61: JP3.2 7.62,35.56 C3.1 10.16,48.26 11.43,49.53 R1.2 21.59,50.8 21.59,57.15 IC2.7 v22.86,57.15 | JP2.2 7.62,74.93 10.16,72.39 12.7,72.39 v13.97,71.12 | 40.64,74.93 40.64,73.66 v39.37,72.39 | 40.64,74.93 JP2.15 | v25.4,72.39 v25.4,71.12 27.94,68.58 IC2.20 27.94,63.5 30.48,60.96 v43.18,60.96 | 91.44,76.2 78.74,76.2 IC4.8 73.66,76.2 46.99,76.2 44.45,73.66 41.91,73.66 40.64,74.93 | 91.44,76.2 95.25,76.2 96.52,74.93 JP4.2 97.79,72.39 99.06,71.12 99.06,67.31 97.79,66.04 97.79,64.77 96.52,63.5 R5.1 | 91.44,76.2 IC3.8 | LED2.K 64.77,15.24 60.96,19.05 JP5.2 C9.2 67.31,27.94 68.58,29.21 v71.12,29.21 | JP6.2 97.79,54.61 R5.1 | R5.1 93.98,55.88 92.71,54.61 R4.1 v83.82,53.34 | v81.28,30.48 U1.16 82.55,27.94 83.82,29.21 C2.1 83.82,35.56 82.55,36.83 81.28,36.83 80.01,38.1 IC1.OUT v83.82,39.37

### Text on the board
Bottom: Annim Banerjee | ECS Device | Developed By: